# Altium schematic sheet Microcontroller.SchDoc
size B
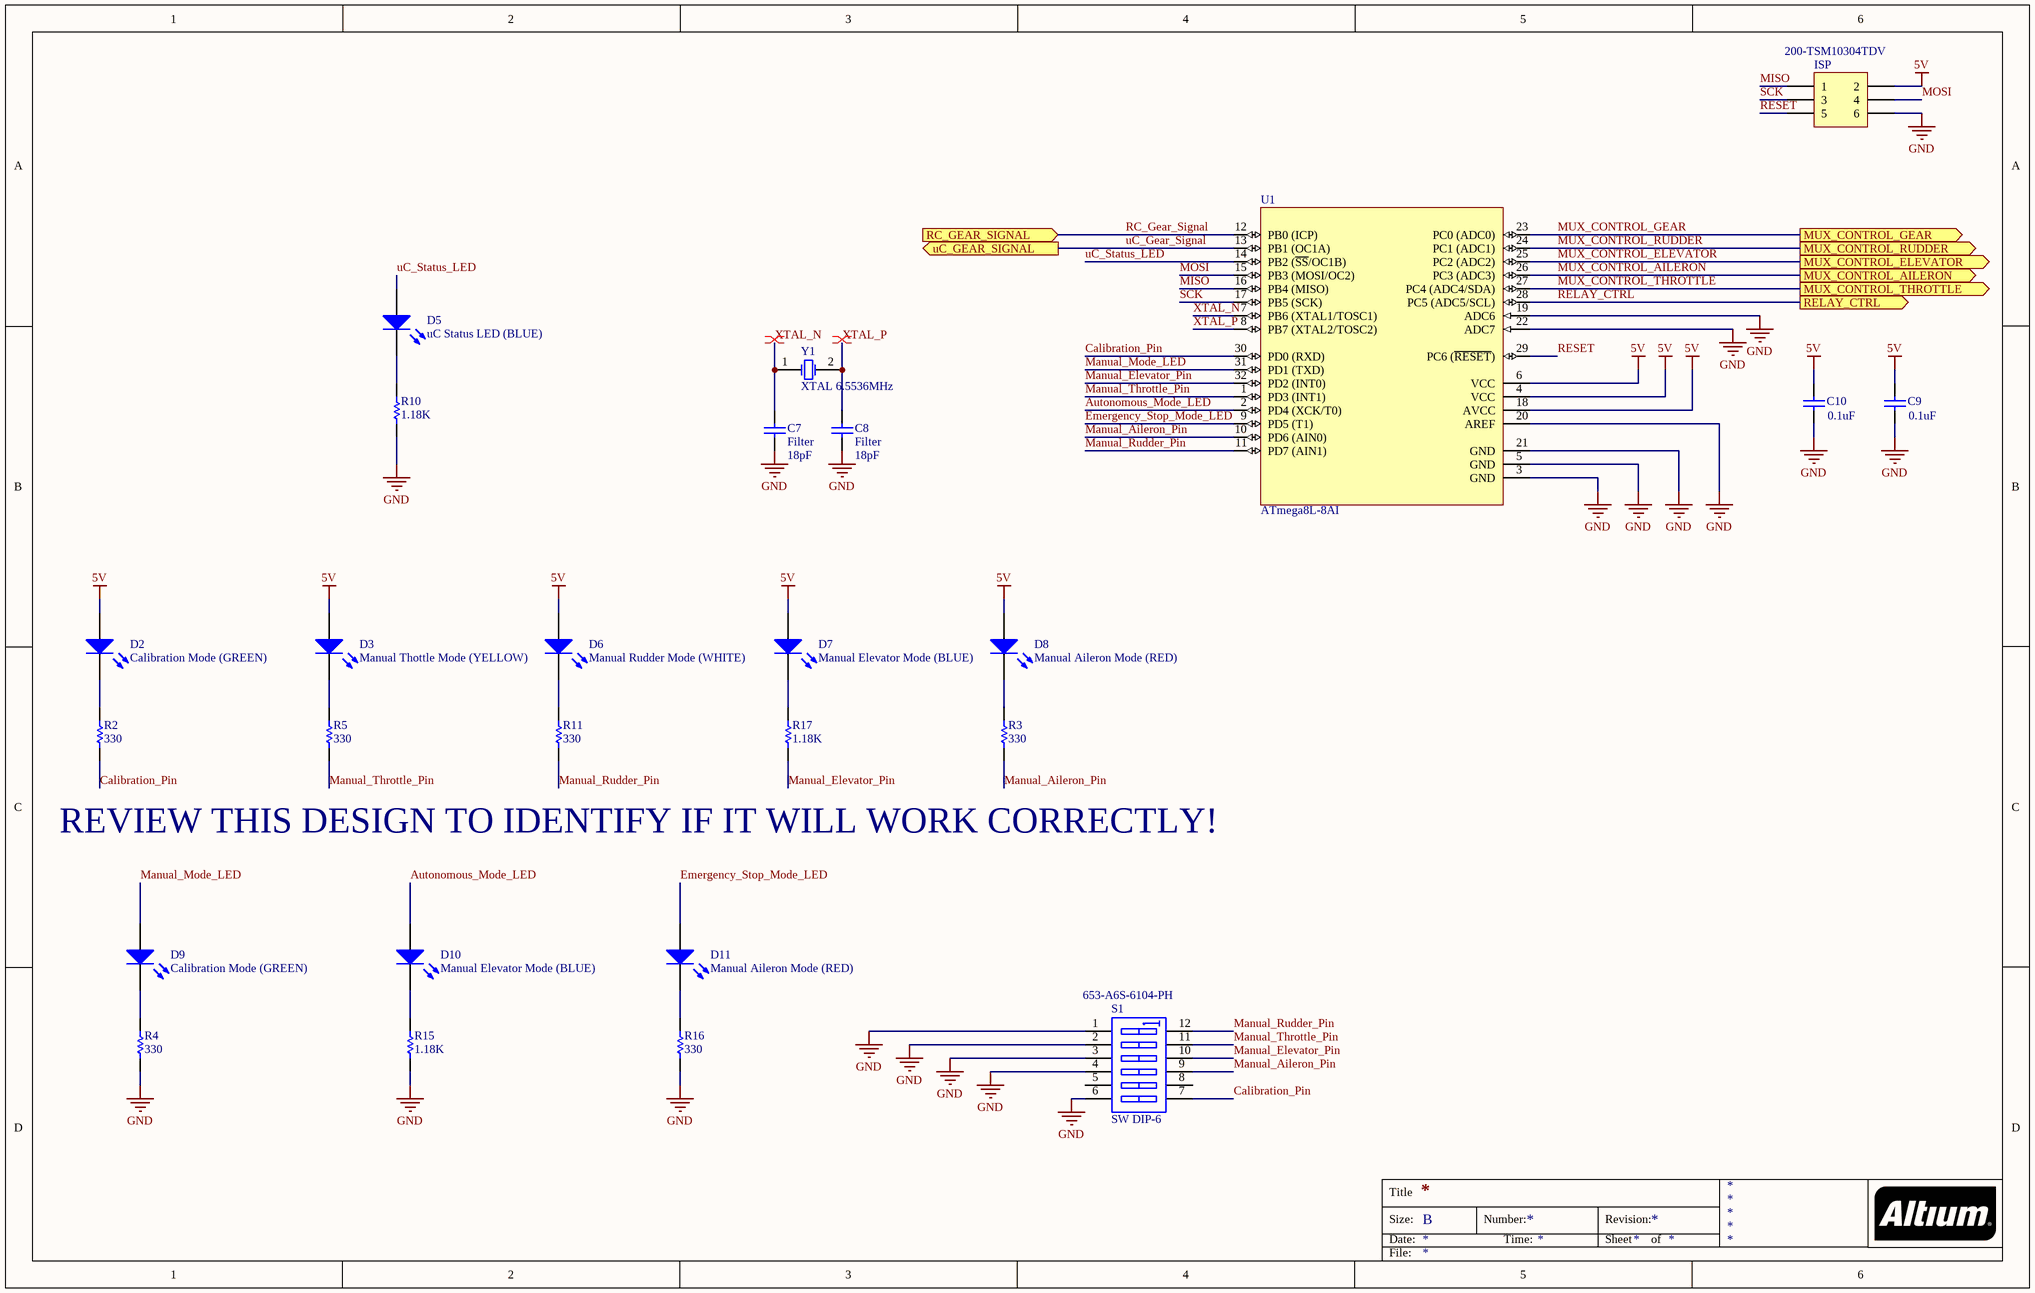
[diagram p0: Microcontroller.SchDoc]

## Parts
C7  Filter  value 18pF  [1608[0603]]
C8  Filter  value 18pF  [1608[0603]]
C9  value 0.1uF  [1608[0603]]  (hidden comment: Bypass Capacitor)
C10  value 0.1uF  [1608[0603]]  (hidden comment: Bypass Capacitor)
D2  Calibration Mode (GREEN)  [1608[0603]]
D3  Manual Thottle Mode (YELLOW)  [1608[0603]]
D5  uC Status LED (BLUE)  [1608[0603]]
D6  Manual Rudder Mode (WHITE)  [1608[0603]]
D7  Manual Elevator Mode (BLUE)  [1608[0603]]
D8  Manual Aileron Mode (RED)  [1608[0603]]
D9  Calibration Mode (GREEN)  [1608[0603]]
D10  Manual Elevator Mode (BLUE)  [1608[0603]]
D11  Manual Aileron Mode (RED)  [1608[0603]]
ISP  Supplier Part Number 1: 200-TSM10304TDV  [HDR2X3]  (hidden comment: Header 3X2)
R2  value 330  [1608[0603]]  (hidden comment: Current Limiting Resistor)
R3  value 330  [1608[0603]]  (hidden comment: Current Limiting Resistor)
R4  value 330  [1608[0603]]  (hidden comment: Current Limiting Resistor)
R5  value 330  [1608[0603]]  (hidden comment: Current Limiting Resistor)
R10  value 1.18K  [1608[0603]]  (hidden comment: Current Limiting Resistor)
R11  value 330  [1608[0603]]  (hidden comment: Current Limiting Resistor)
R15  value 1.18K  [1608[0603]]  (hidden comment: Current Limiting Resistor)
R16  value 330  [1608[0603]]  (hidden comment: Current Limiting Resistor)
R17  value 1.18K  [1608[0603]]  (hidden comment: Current Limiting Resistor)
S1  SW DIP-6  Supplier Part Number 1: 653-A6S-6104-PH  [A6S-6104-H]
U1  ATmega8L-8AI  [32A_N]
Y1  XTAL 6.5536MHz  [HC49/4H_SMX]

## Ports
MUX_CONTROL_AILERON (out), MUX_CONTROL_ELEVATOR (out), MUX_CONTROL_GEAR (out), MUX_CONTROL_RUDDER (out), MUX_CONTROL_THROTTLE (out), RC_GEAR_SIGNAL (in), RELAY_CTRL (out), uC_GEAR_SIGNAL (out)

## Nets
5V: C9.1 C10.1 D2.1(A) D3.1(A) D6.1(A) D7.1(A) D8.1(A) ISP.2 U1.4(VCC) U1.6(VCC) U1.18(AVCC)
GND: C7.1 C8.1 C9.2 C10.2 ISP.6 R4.1 R10.1 R15.1 R16.1 S1.1(A1) S1.2(A2) S1.3(A3) S1.4(A4) S1.6(A6) U1.3(GND) U1.5(GND) U1.19(ADC6) U1.20(AREF) U1.21(GND) U1.22(ADC7)
Autonomous_Mode_LED: D10.1(A) U1.2(PD4_(XCK/T0))
Calibration_Pin: R2.1 S1.7(B6) U1.30(PD0_(RXD))
Emergency_Stop_Mode_LED: D11.1(A) U1.9(PD5_(T1))
Manual_Aileron_Pin: R3.1 S1.9(B4) U1.10(PD6_(AIN0))
Manual_Elevator_Pin: R17.1 S1.10(B3) U1.32(PD2_(INT0))
Manual_Mode_LED: D9.1(A) U1.31(PD1_(TXD))
Manual_Rudder_Pin: R11.1 S1.12(B1) U1.11(PD7_(AIN1))
Manual_Throttle_Pin: R5.1 S1.11(B2) U1.1(PD3_(INT1))
MISO: ISP.1 U1.16(PB4_(MISO))
MOSI: ISP.4 U1.15(PB3_(MOSI/OC2))
MUX_CONTROL_AILERON: U1.26(PC3_(ADC3)) ; port MUX_CONTROL_AILERON
MUX_CONTROL_ELEVATOR: U1.25(PC2_(ADC2)) ; port MUX_CONTROL_ELEVATOR
MUX_CONTROL_GEAR: U1.23(PC0_(ADC0)) ; port MUX_CONTROL_GEAR
MUX_CONTROL_RUDDER: U1.24(PC1_(ADC1)) ; port MUX_CONTROL_RUDDER
MUX_CONTROL_THROTTLE: U1.27(PC4_(ADC4/SDA)) ; port MUX_CONTROL_THROTTLE
RC_Gear_Signal: U1.12(PB0_(ICP)) ; port RC_GEAR_SIGNAL
RELAY_CTRL: U1.28(PC5_(ADC5/SCL)) ; port RELAY_CTRL
RESET: ISP.5 U1.29(PC6_(~{RESET}))
SCK: ISP.3 U1.17(PB5_(SCK))
uC_Gear_Signal: U1.13(PB1_(OC1A)) ; port uC_GEAR_SIGNAL
uC_Status_LED: D5.1(A) U1.14(PB2_(~{SS}/OC1B))
XTAL_N: C7.2 U1.7(PB6_(XTAL1/TOSC1)) Y1.1(OSC1)
XTAL_P: C8.2 U1.8(PB7_(XTAL2/TOSC2)) Y1.2(OSC2)
NetD2_2: D2.2(K) R2.2
NetD3_2: D3.2(K) R5.2
NetD5_2: D5.2(K) R10.2
NetD6_2: D6.2(K) R11.2
NetD7_2: D7.2(K) R17.2
NetD8_2: D8.2(K) R3.2
NetD9_2: D9.2(K) R4.2
NetD10_2: D10.2(K) R15.2
NetD11_2: D11.2(K) R16.2

Not connected (* = marked no-connect by the designer): S1 5(A5) 8(B5)

## Layout directives
differential pair: XTAL_N, XTAL_P

## Notes on the sheet
- REVIEW THIS DESIGN TO IDENTIFY IF IT WILL WORK CORRECTLY!
- Title
- Size:
- Date:
- B
- Number:
- Time:
- Revision:
- Sheet
- of
- File:

## Library data of the parts
C7 C8 = Cap: Capacitor; Manufacturer: KEMET; Manufacturer Part Number: CBR06C180FAGAC; Tolerance: 1%; Voltage Rating: 250V; Published: 8-Jun-2000; LatestRevisionDate: 17-Jul-2002; LatestRevisionNote: Re-released for DXP Platform.; PackageReference: RAD-0.3; Publisher: Altium Limited; PackageDescription: Radial Cap, Thru-Hole; 2 Leads; 0.3 in Pin Spacing; Supplier 1: Mouser; Supplier Part Number 1: 80-CBR06C180FAGAC; Thickness: 0.034inch; Min Operating Temperature: -55°C; Case/Package: 0603; Max Operating Temperature: 125°C; Width: 0.031inch; Length: 0.063inch; ComponentLink1URL: https://datasheet.ciiva.com/6258/kem-c1030-cbr-smd-6258345.pdf; ComponentLink1Description: https://datasheet.ciiva.com/6258/kem-c1030-cbr-smd-6258345.pdf; ComponentLink2URL: https://datasheet.ciiva.com/6258/kem-c1030-cbr-smd-6258342.pdf; ComponentLink2Description: https://datasheet.ciiva.com/6258/kem-c1030-cbr-smd-6258342.pdf
C9 C10 = Cap: Multilayer Ceramic Capacitors MLCC - SMD/SMT 0603 .1uF 50volts X7R 10%; Manufacturer Part Number: VJ0603Y104KXAAC; Manufacturer: Vishay Semiconductors; Voltage Rating (DC): 50V; Supplier 1: Mouser; Supplier Part Number 1: 77-VJ0603Y104KXAAC; Min Operating Temperature: -55°C; Max Operating Temperature: 150°C; Tolerance: 10%; Lead Free: Lead Free; Depth: 0.8mm; Case/Package: 0603; Dielectric: X7R; Length: 1.6mm; ComponentLink1Description: Datasheet; ComponentLink1URL: https://www.mouser.com/datasheet/2/427/vjcommercialseries-222796.pdf
D2 D9 = LED0: Standard LEDs - SMD Ultra Green, 574nm 2.2V, 45mcd; Manufacturer: Lumex; Manufacturer Part Number: SML-LX0603SUGW-TR; Viewing Angle: 140°; Forward Current: 20mA; Lens Colour: White; Supplier 1: Mouser; Supplier Part Number 1: 696-SML-LX0603SUGW; Lead Free: Lead Free; Luminous Intensity: 45mcd; Length: 1.6mm; Width: 0.8mm; Height: 0.6mm; Test Current: 20mA; Dominant Wavelength: 574nm; Min Operating Temperature: -25°C; Max Operating Temperature: 85°C; Wavelength: 574nm; Case/Package: 0603; Forward Voltage: 2.2V; Colour: Green; ComponentLink1URL: https://datasheet.ciiva.com/7639/671274-7639178.pdf; ComponentLink1Description: https://datasheet.ciiva.com/7639/671274-7639178.pdf; ComponentLink2URL: https://datasheet.ciiva.com/2111/sml-lx0603sugw-tr-2111273.pdf; ComponentLink2Description: https://datasheet.ciiva.com/2111/sml-lx0603sugw-tr-2111273.pdf; ComponentLink3URL: https://datasheet.ciiva.com/7639/671274-7639177.pdf; ComponentLink3Description: https://datasheet.ciiva.com/7639/671274-7639177.pdf; ComponentLink4URL: https://datasheet.ciiva.com/46391/671274-46391015.pdf; ComponentLink4Description: https://datasheet.ciiva.com/46391/671274-46391015.pdf; ComponentLink5URL: https://datasheet.ciiva.com/2111/sml-lx0603sugw-tr-2111272.pdf; ComponentLink5Description: https://datasheet.ciiva.com/2111/sml-lx0603sugw-tr-2111272.pdf; ComponentLink6URL: https://datasheet.ciiva.com/2111/sml-lx0603sugw-tr-2111271.pdf; ComponentLink6Description: https://datasheet.ciiva.com/2111/sml-lx0603sugw-tr-2111271.pdf; ComponentLink7URL: https://datasheet.ciiva.com/4688/sml-lx0603sugw-tr-113249-4688850.pdf; ComponentLink7Description: https://datasheet.ciiva.com/4688/sml-lx0603sugw-tr-113249-4688850.pdf; ComponentLink8URL: https://datasheet.ciiva.com/16215/sml-lx0603sugw-tr-16215364.pdf; ComponentLink8Description: https://datasheet.ciiva.com/16215/sml-lx0603sugw-tr-16215364.pdf; ComponentLink9URL: https://datasheet.ciiva.com/30110/sml-lx0603sugw-tr-30110777.pdf; ComponentLink9Description: https://datasheet.ciiva.com/30110/sml-lx0603sugw-tr-30110777.pdf
D3 = LED0: Standard LEDs - SMD Yellow 589nm 22mcd 5mA; Manufacturer Part Number: LTST-C193KSKT-5A; Manufacturer: Vishay Lite-On; Forward Voltage: 2.3V; Dominant Wavelength: 594.5nm; Viewing Angle: 130°; Forward Current: 30mA; Lens Style: Diffused,Colorless,Rectangular; Lens Colour: Clear,Colorless; Lens Transparency: Clear; Reverse Voltage: 5V; Power Dissipation: 75mW; Luminous Intensity: 45mcd; Supplier 1: Mouser; Supplier Part Number 1: 859-LTSTC193KSKT5A; Test Current: 5mA; Colour: Yellow; Depth: 0.8mm; Max Operating Temperature: 85°C; Width: 0.8mm; Lead Free: Lead Free; Min Operating Temperature: -55°C; Case/Package: 0603; Length: 1.6mm; Height: 0.35mm; ComponentLink1URL: https://datasheet.ciiva.com/2110/s-110-ltst-c193kskt-5a-2110276.pdf; ComponentLink1Description: https://datasheet.ciiva.com/2110/s-110-ltst-c193kskt-5a-2110276.pdf; ComponentLink2URL: https://datasheet.ciiva.com/2110/s-110-ltst-c193kskt-5a-2110277.pdf; ComponentLink2Description: https://datasheet.ciiva.com/2110/s-110-ltst-c193kskt-5a-2110277.pdf; ComponentLink3URL: https://datasheet.ciiva.com/2110/s-110-ltst-c193kskt-5a-2110278.pdf; ComponentLink3Description: https://datasheet.ciiva.com/2110/s-110-ltst-c193kskt-5a-2110278.pdf; ComponentLink4URL: https://datasheet.ciiva.com/26890/getdatasheetpartid-683868-26890500.pdf; ComponentLink4Description: https://datasheet.ciiva.com/26890/getdatasheetpartid-683868-26890500.pdf; ComponentLink5URL: https://datasheet.ciiva.com/4688/lite-on-ltst-c193kskt-5a-187434-4688750.pdf; ComponentLink5Description: https://datasheet.ciiva.com/4688/lite-on-ltst-c193kskt-5a-187434-4688750.pdf; ComponentLink6URL: https://datasheet.ciiva.com/11775/0900766b80dc0553-11775611.pdf; ComponentLink6Description: https://datasheet.ciiva.com/11775/0900766b80dc0553-11775611.pdf
D5 D7 D10 = LED0: Standard LEDs - SMD 0603 Dome Lens LED Blue- 470nm; Manufacturer Part Number: APHD1608LVBC/D; Manufacturer: Kingbright; Luminous Intensity: 45 mcd; If - Forward Current: 2mA; Vf - Forward Voltage: 2.65V; Supplier 1: Mouser; Supplier Part Number 1: 604-APHD1608LVBCD; ComponentLink1Description: Datasheet; ComponentLink1URL: https://www.mouser.com/datasheet/2/216/APHD1608LVBC-D-1100823.pdf; Minimum Operating Temperature: -40C; Maximum Operating Temperature: +85C
D6 = LED0: Standard LEDs - SMD CHIPLED, WHITE; Manufacturer: Osram Opto; Manufacturer Part Number: Q65110-A7209; Forward Current: 15mA; Test Current: 5mA; Forward Voltage: 3.2V; Luminous Flux: 0.6lm; Reverse Voltage: 5V; Lens Style: Diffused,Colored,Rectangular; Luminous Intensity: 224mcd; Supplier 1: Mouser; Supplier Part Number 1: 720-LWQ38GQ1S13K6L1; Colour: White; Depth: 0.9mm; Min Operating Temperature: -40°C; Max Operating Temperature: 85°C; Length: 1.7mm; ComponentLink1URL: https://datasheet.ciiva.com/26937/getdatasheetpartid-780965-26937253.pdf; ComponentLink1Description: https://datasheet.ciiva.com/26937/getdatasheetpartid-780965-26937253.pdf
D8 D11 = LED0: Standard LEDs - SMD Super Red, 660nm 1.7V, 45mcd; Manufacturer Part Number: SML-LX0603SRW-TR; Manufacturer: Lumex; Forward Current: 20mA; Viewing Angle: 140°; Power Rating: 50mW; Lens Colour: White; Lens Style: Diffused,Colorless,Rectangular; Lens Transparency: Diffused; Supplier 1: Mouser; Supplier Part Number 1: 696-SML-LX0603SRW; Min Operating Temperature: -25°C; Length: 1.6mm; Lead Free: Lead Free; Case Code (Imperial): 0603; Colour: Red; Forward Voltage: 1.7V; Max Operating Temperature: 85°C; Wavelength: 660nm; Height: 0.6mm; Luminous Intensity: 45mcd; Case Code (Metric): 1608; Width: 0.8mm; Illumination Colour: Red; Test Current: 20mA; ComponentLink1URL: https://datasheet.ciiva.com/2110/sml-lx0603srw-tr-2110094.pdf; ComponentLink1Description: https://datasheet.ciiva.com/2110/sml-lx0603srw-tr-2110094.pdf; ComponentLink2URL: https://datasheet.ciiva.com/7639/269316-7639176.pdf; ComponentLink2Description: https://datasheet.ciiva.com/7639/269316-7639176.pdf; ComponentLink3URL: https://datasheet.ciiva.com/16200/sml-lx0603srw-tr-16200056.pdf; ComponentLink3Description: https://datasheet.ciiva.com/16200/sml-lx0603srw-tr-16200056.pdf; ComponentLink4URL: https://datasheet.ciiva.com/2110/sml-lx0603srw-tr-2110093.pdf; ComponentLink4Description: https://datasheet.ciiva.com/2110/sml-lx0603srw-tr-2110093.pdf; ComponentLink5URL: https://datasheet.ciiva.com/7639/269316-7639175.pdf; ComponentLink5Description: https://datasheet.ciiva.com/7639/269316-7639175.pdf; ComponentLink6URL: https://datasheet.ciiva.com/2110/sml-lx0603srw-tr-2110095.pdf; ComponentLink6Description: https://datasheet.ciiva.com/2110/sml-lx0603srw-tr-2110095.pdf; ComponentLink7URL: https://datasheet.ciiva.com/30115/sml-lx0603srw-tr-30115864.pdf; ComponentLink7Description: https://datasheet.ciiva.com/30115/sml-lx0603srw-tr-30115864.pdf; ComponentLink8URL: https://datasheet.ciiva.com/15967/sml-lx0603srw-tr-15967174.pdf; ComponentLink8Description: https://datasheet.ciiva.com/15967/sml-lx0603srw-tr-15967174.pdf; ComponentLink9URL: https://datasheet.ciiva.com/4689/sml-lx0603srw-tr-113242-4689205.pdf; ComponentLink9Description: https://datasheet.ciiva.com/4689/sml-lx0603srw-tr-113242-4689205.pdf
ISP = Header 3X2: Header, 3-Pin, Dual row; Manufacturer: Samtec; Manufacturer Part Number: TSM-103-04-T-DV; Max Current Rating: 7A; Pitch: 2.54mm; Number of Contacts: 6; Gender: Male; Max Voltage Rating (AC): 475V; LatestRevisionDate: 17-Jul-2002; LatestRevisionNote: Re-released for DXP Platform.; Publisher: Altium Limited; Supplier 1: Mouser; Depth: 5.08mm; Contact Plating: Tin; Lead Free: Lead Free; Housing Material: Polymer; Length: 7.62mm; Min Operating Temperature: -55°C; Max Operating Temperature: 105°C; Housing Colour: Black; Orientation: Straight; Contact Material: Bronze; Number of Rows: 2; ComponentLink1URL: http://datasheet.octopart.com/TSM-103-04-T-DV-Samtec-datasheet-31667586.pdf; ComponentLink1Description: http://datasheet.octopart.com/TSM-103-04-T-DV-Samtec-datasheet-31667586.pdf; ComponentLink2URL: http://datasheet.octopart.com/TSM-103-04-T-DV-Samtec-datasheet-12008796.pdf; ComponentLink2Description: http://datasheet.octopart.com/TSM-103-04-T-DV-Samtec-datasheet-12008796.pdf; ComponentLink3URL: http://datasheet.octopart.com/TSM-103-04-T-DV-Samtec-datasheet-10407325.pdf; ComponentLink3Description: http://datasheet.octopart.com/TSM-103-04-T-DV-Samtec-datasheet-10407325.pdf; ComponentLink4URL: http://datasheet.octopart.com/TSM-103-04-T-DV-Samtec-datasheet-21214708.pdf; ComponentLink4Description: http://datasheet.octopart.com/TSM-103-04-T-DV-Samtec-datasheet-21214708.pdf; ComponentLink5URL: http://datasheet.octopart.com/TSM-103-04-T-DV-Samtec-datasheet-11542650.pdf; ComponentLink5Description: http://datasheet.octopart.com/TSM-103-04-T-DV-Samtec-datasheet-11542650.pdf; ComponentLink6URL: http://datasheet.octopart.com/TSM-103-04-T-DV-Samtec-datasheet-41643181.pdf; ComponentLink6Description: http://datasheet.octopart.com/TSM-103-04-T-DV-Samtec-datasheet-41643181.pdf; ComponentLink7URL: http://datasheet.octopart.com/TSM-103-04-T-DV-Samtec-datasheet-68527555.pdf; ComponentLink7Description: http://datasheet.octopart.com/TSM-103-04-T-DV-Samtec-datasheet-68527555.pdf; ComponentLink8URL: http://sigma.octopart.com/97319595/technical_drawing/Samtec-TSM-103-04-T-DV.pdf; ComponentLink8Description: http://sigma.octopart.com/97319595/technical_drawing/Samtec-TSM-103-04-T-DV.pdf; ComponentLink9URL: http://datasheet.octopart.com/TSM-103-04-T-DV-Samtec-datasheet-97319594.pdf; ComponentLink9Description: http://datasheet.octopart.com/TSM-103-04-T-DV-Samtec-datasheet-97319594.pdf
R2-R5 R11 R16 = Res1: Thick Film Resistors - SMD 330 ohm 0.5% 0.33W AEC-Q200; Manufacturer: KOA Speer; Manufacturer Part Number: SG73G1JTTD3300D; Power Rating: 330mW; Supplier 1: Mouser; Supplier Part Number 1: 660-SG73G1JTTD3300D; ComponentLink1Description: Datasheet; ComponentLink1URL: https://www.mouser.com/datasheet/2/219/SG73G-1316861.pdf; Tolerance: 0.5%
R10 R15 R17 = Res1: Thin Film Resistors - SMD 1/16W 1.18Kohm 0.5% 25ppm; Manufacturer: Susumu; Manufacturer Part Number: RR0816P-1181-D-08H; Power Rating: 62.5mW; Voltage Rating: 75V; Max Power Dissipation: 63mW; Temperature Coefficient: 25ppm/°C; ComponentLink1Description: Datasheet; ComponentLink1URL: https://www.mouser.com/datasheet/2/219/SG73G-1316861.pdf; Supplier 1: Mouser; Supplier Part Number 1: 754-RR0816P-1181D08H; Case/Package: 0603; Weight: 7.1E-05oz; Min Operating Temperature: -55°C; Max Operating Temperature: 125°C; Composition: Thin Film; Tolerance: 0.5%; Length: 0.063inch; Height: 0.02inch; Width: 0.031inch; Lead Free: Lead Free; ComponentLink2URL: https://datasheet.ciiva.com/2518/rr-data-sheet-2518672.pdf; ComponentLink2Description: https://datasheet.ciiva.com/2518/rr-data-sheet-2518672.pdf; ComponentLink3URL: https://datasheet.ciiva.com/2518/rr-data-sheet-2518670.pdf; ComponentLink3Description: https://datasheet.ciiva.com/2518/rr-data-sheet-2518670.pdf; ComponentLink4URL: https://datasheet.ciiva.com/2518/rr-data-sheet-2518671.pdf; ComponentLink4Description: https://datasheet.ciiva.com/2518/rr-data-sheet-2518671.pdf
S1 = SW DIP-6: DIP Switches / SIP Switches 6 Pole Raised Act. Dip SW; Manufacturer Part Number: A6S-6104-PH; Manufacturer: Omron; Throw Configuration: SPST; Electrical Life: 1000Cycles; Voltage Rating (DC): 24V; Current Rating: 25mA; Pitch: 0.1inch; PackageReference: DIP-12/SW; PackageDescription: DIP Switch; 12 Leads; Supplier 1: Mouser; Length: 0.637inch; Contact Plating: Gold; Max Operating Temperature: 70°C; Min Operating Temperature: -20°C; Max Voltage Rating (DC): 24V; Termination: Gull Wing; ComponentLink1URL: https://datasheet.ciiva.com/48485/en-a6s-48485127.pdf; ComponentLink1Description: https://datasheet.ciiva.com/48485/en-a6s-48485127.pdf; ComponentLink2URL: https://datasheet.ciiva.com/5258/a6s-h-1110-11975-5258393.pdf; ComponentLink2Description: https://datasheet.ciiva.com/5258/a6s-h-1110-11975-5258393.pdf
U1 = ATmega8L-8AI: 8-Bit AVR Microcontroller with 8K Bytes of In-System Programmable Flash Memory; Published: 17-Sep-2003; LatestRevisionDate: 16-Oct-2006; LatestRevisionNote: IPC-7351 Footprint Added.; DatasheetVersion: 2486H-AVR-09/02; PackageVersion: revB, Oct-2001; PackageReference: 32A; Publisher: Altium Limited; PackageDescription: 32-Lead, 7x7x1.0 mm Body, 0.8mm Lead Pitch, Thin Profile Plastic Quad Flat Package (TQFP); Supplier 1: Digi-Key; Supplier Part Number 1: ATMEGA8L-8AI-ND; Supplier 2: Farnell; Supplier Part Number 2: 3917952; Supplier 3: Mouser; Supplier Part Number 3: 556-ATMEGA8L-8AU; Code_JEDEC: MS-026-ABA; ComponentLink1Description: Datasheet; ComponentLink1URL: http://www.atmel.com/dyn/resources/prod_documents/doc2486.pdf
Y1 = XTAL: Crystals 6.5536MHz SERIES; Manufacturer: ECS International; Manufacturer Part Number: ECS-65.5-S-5PX-TR; Frequency Stability: 50ppm; Tolerance: 30ppm; Shunt Capacitance: 7pF; Maximum ESR: 70; Drive Level: 500uW; Supplier 1: Mouser; Supplier Part Number 1: 520-CSM655-S-X; Max Operating Temperature: 70°C; Min Operating Temperature: -10°C; Height: 4.3mm; Length: 13.2mm; Width: 4.8mm; Frequency: 6.5536MHz; ComponentLink1Description: Datasheet; ComponentLink1URL: https://www.mouser.com/datasheet/2/122/csm-7x-1299.pdf; Load Capacitance: Series